# EAGLE design clickclack-mk-1.1-a (EAGLE 6.5.0)
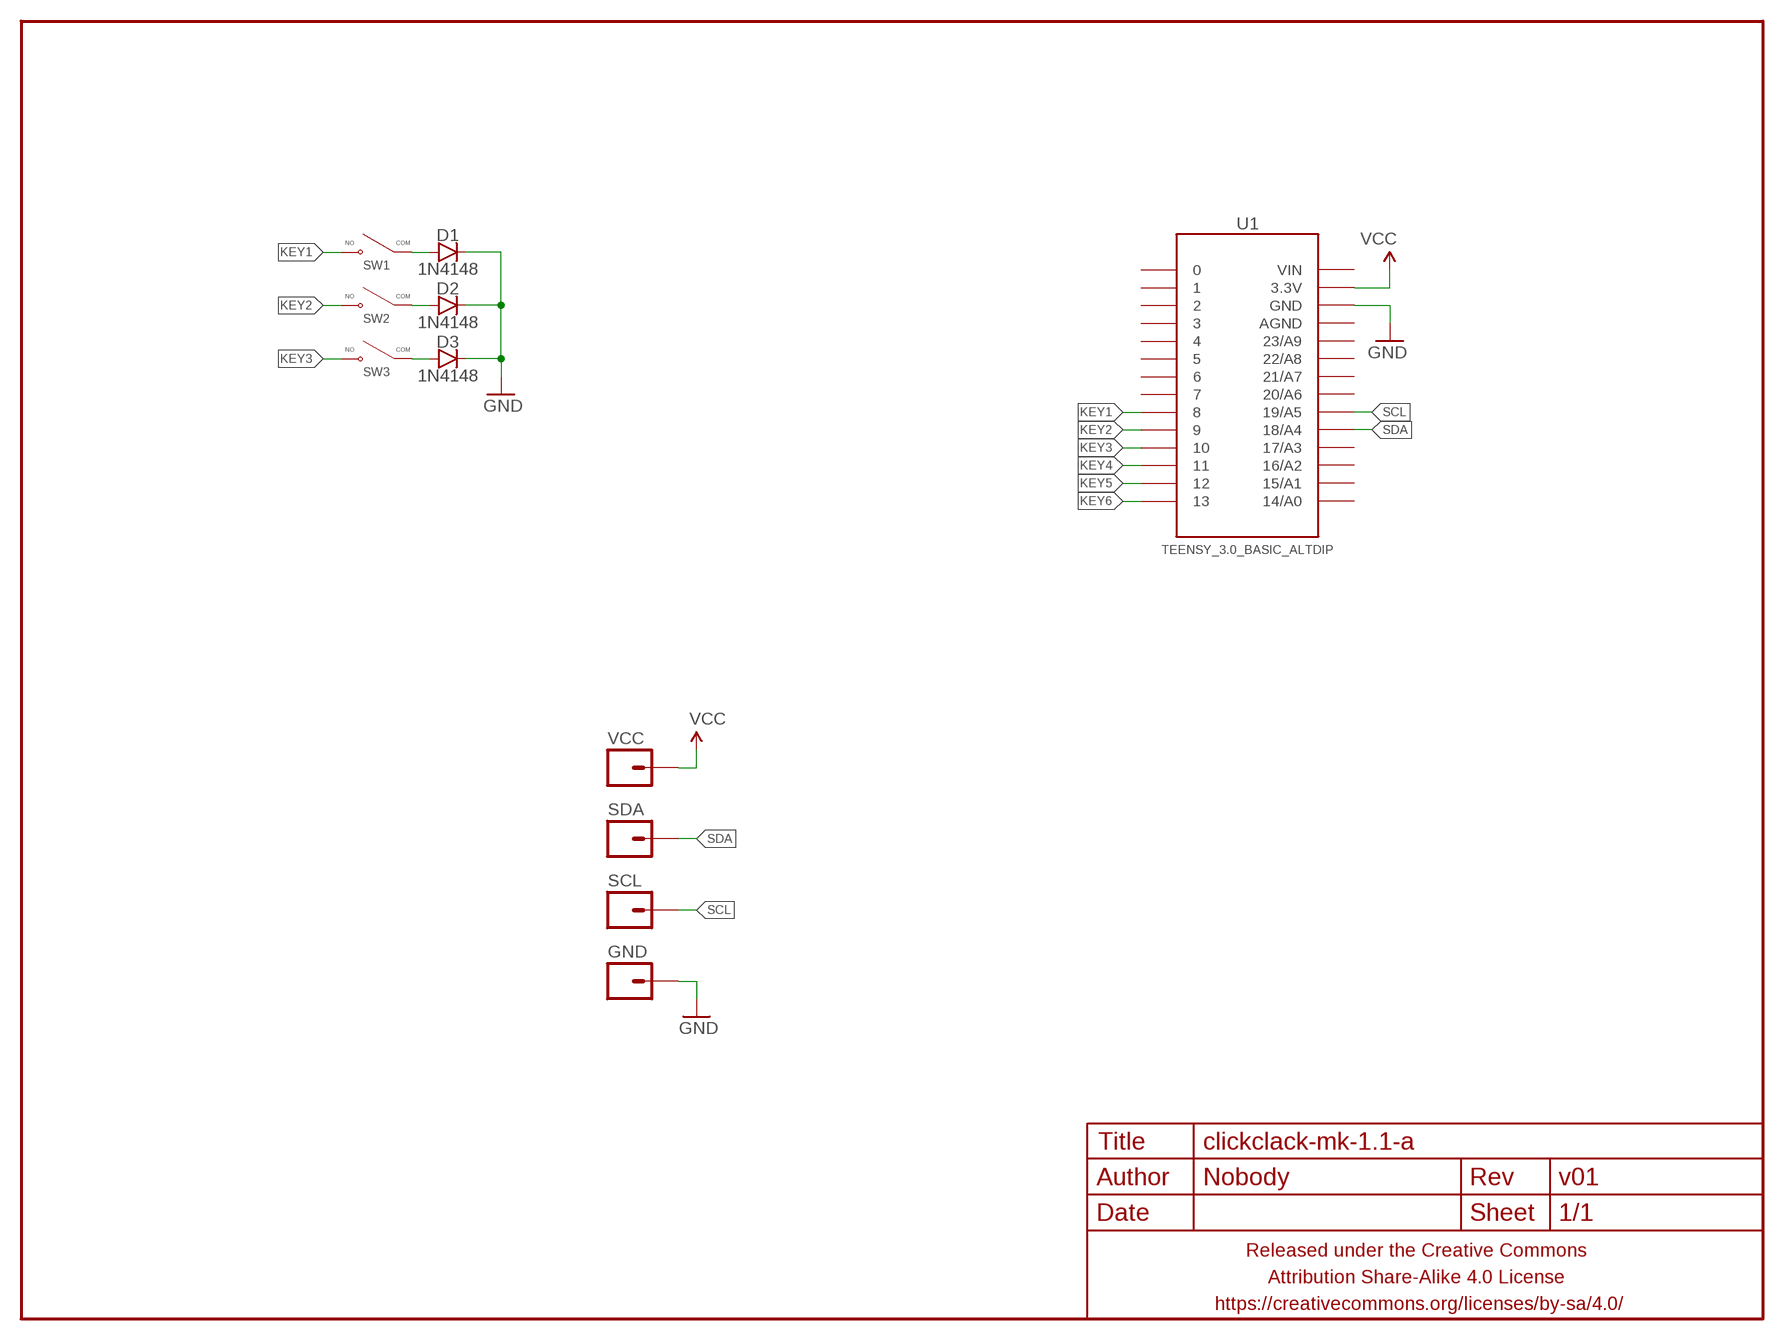
[diagram p0: schematic, sheet 1]

## Parts
D1  1N4148  DIODEPTH-7.62MM  [DIODE-7.62MM]
D2  1N4148  DIODEPTH-7.62MM  [DIODE-7.62MM]
D3  1N4148  DIODEPTH-7.62MM  [DIODE-7.62MM]
FRAME1  FRAME-LETTERNO_PACKAGE  [DUMMY]
GND  M01PTH  [1X01]
SCL  M01PTH  [1X01]
SDA  M01PTH  [1X01]
SW1  CHERRY-MXNONUBS  [CHERRY-MX-NONUBS]
SW2  CHERRY-MXNONUBS  [CHERRY-MX-NONUBS]
SW3  CHERRY-MXNONUBS  [CHERRY-MX-NONUBS]
U1  TEENSY_3.0_BASIC_ALTDIP  [TEENSY_3.0_BASIC_ALT2]
VCC  M01PTH  [1X01]

## Nets
GND: D1.K(C) D2.K(C) D3.K(C) GND.1 U1.GND
KEY1: SW1.2(NO) U1.8
KEY2: SW2.2(NO) U1.9
KEY3: SW3.2(NO) U1.10
KEY4: U1.11
KEY5: U1.12
KEY6: U1.13
N$1: D1.A SW1.1(COM)
N$2: D2.A SW2.1(COM)
N$3: D3.A SW3.1(COM)
SCL: SCL.1 U1.19/A5
SDA: SDA.1 U1.18/A4
VCC: U1.3.3V VCC.1
Unconnected: U1.0 U1.1 U1.2 U1.3 U1.4 U1.5 U1.6 U1.7 U1.14/A0 U1.15/A1 U1.16/A2 U1.17/A3 U1.20/A6 U1.21/A7 U1.22/A8 U1.23/A9

## Power pins joined to a net without a drawn wire
AGND: U1.AGND
VIN: U1.VIN

## Library data of the parts
D1-D3 = A_butts:DIODE: Diode These are standard reverse protection diodes and small signal diodes. SMA package can handle up to about 1A. SOD-323 can handle about 200mA. What the SOD-323 package when ordering, there are some mfgs out there that are 5-pin packages.
FRAME1 = A_butts:FRAME-LETTER: Schematic Frame Standard 8.5x11 US Letter frame; DESIGNER: Nobody; VERSION: v01
GND SCL SDA VCC = A_butts:M01: Header 1 Standard 1-pin 0.1" header. Use with straight break away headers (SKU : PRT-00116), right angle break away headers (PRT-00553), swiss pins (PRT-00743), machine pins (PRT-00117), and female headers (PRT-00115).
SW1-SW3 = A_butts:CHERRY-MX
U1 = A_butts:TEENSY_3.0_BASIC_ALT

## Board
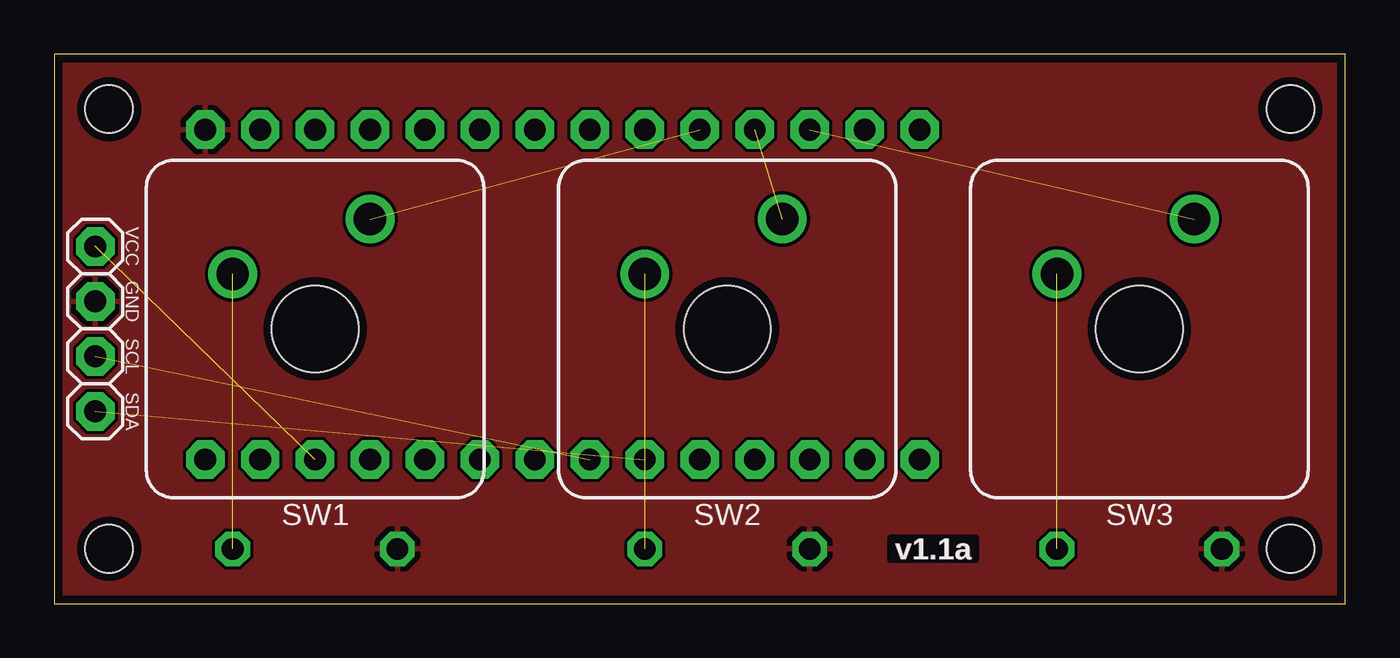
[diagram p1: board, top side]
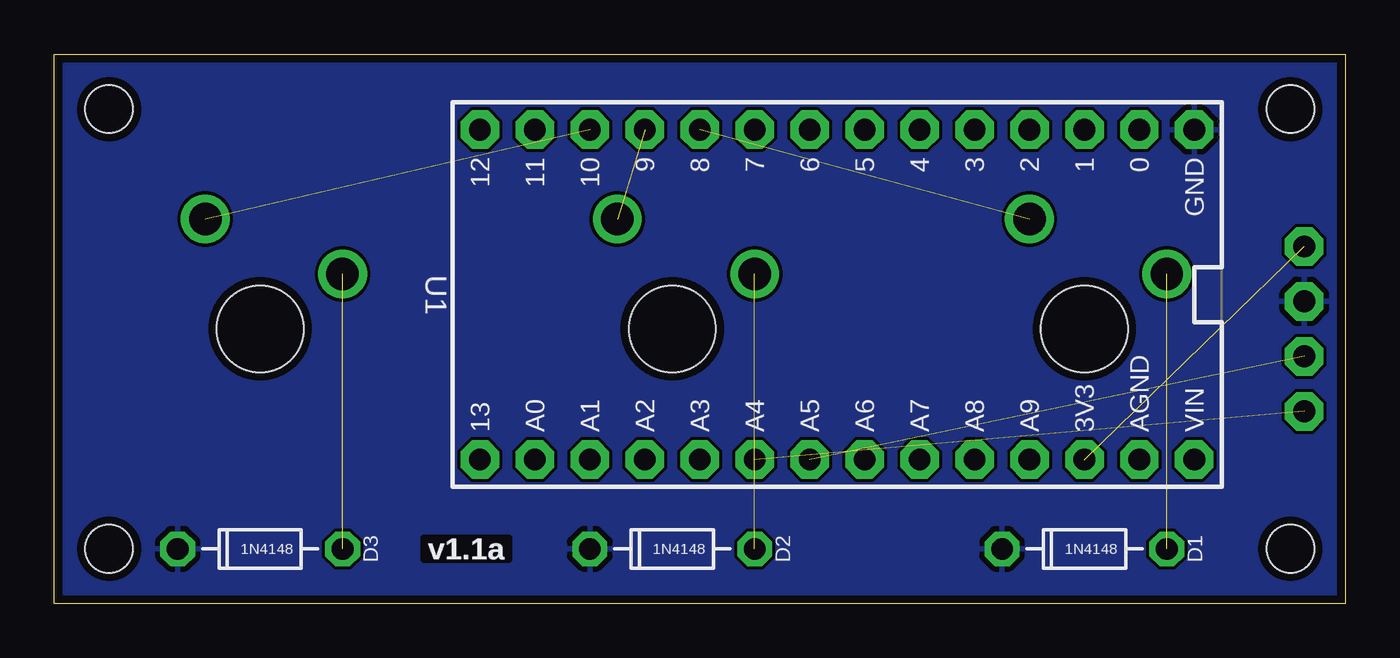
[diagram p2: board, bottom side, seen from below]

Size 59.69 x 25.4 mm. Coordinates in mm from the lower left corner, seen from the top.
Outline: 0,25.4 0,0 59.69,0 59.69,25.4 0,25.4
Copper layers (1*16): Top 0.0356mm / dielectric 1.5011mm / Bottom 0.0356mm
Design rules "LaenPCBOrder_2": minimum track width 6mil, minimum drill 13mil, track to track 6mil, track to pad 6mil, pad to pad 6mil, via to via 6mil, smd to smd 6mil, copper to edge 15mil, drill to drill 6mil, minimum pad ring 7mil, minimum via ring 7mil, stop-mask expansion 3mil, vias tented up to drill 20mil, thermal gap 10mil
Holes 2.2 mm at 2.54,22.86 2.54,2.54 57.15,22.86 57.15,2.54

### Footprints (pad centres in the part's own frame; a part is rotated, then mirrored left to right if it is on the bottom)
DIODE-7.62MM = drill 1 pad 1.6 octagon: A -3.81,0; K 3.81,0
1X01 = drill 1.016 pad 1.778 octagon: 1 0,0
CHERRY-MX-NONUBS = drill 1.5: 1 -3.81,2.54; 2 2.54,5.08 | hole 4: 0,0
TEENSY_3.0_BASIC_ALT2 = drill 1 pad 1.778 octagon: 0 -7.62,13.97; 1 -7.62,11.43; 2 -7.62,8.89; 3 -7.62,6.35; 3.3V 7.62,11.43; 4 -7.62,3.81; 5 -7.62,1.27; 6 -7.62,-1.27; 7 -7.62,-3.81; 8 -7.62,-6.35; 9 -7.62,-8.89; 10 -7.62,-11.43; 11 -7.62,-13.97; 12 -7.62,-16.51; 13 7.62,-16.51; 14/A0 7.62,-13.97; 15/A1 7.62,-11.43; 16/A2 7.62,-8.89; 17/A3 7.62,-6.35; 18/A4 7.62,-3.81; 19/A5 7.62,-1.27; 20/A6 7.62,1.27; 21/A7 7.62,3.81; 22/A8 7.62,6.35; 23/A9 7.62,8.89; AGND 7.62,13.97; GND -7.62,16.51; VIN 7.62,16.51

### Placement (x,y rotation side)
D1  12.06,2.54 180 bottom
D2  31.11,2.54 180 bottom
D3  50.16,2.54 180 bottom
FRAME1  0,0 0 top
GND  1.91,13.97 270 top
SCL  1.91,11.43 270 top
SDA  1.91,8.89 270 top
SW1  12.06,12.7 0 top
SW2  31.11,12.7 0 top
SW3  50.16,12.7 0 top
U1  23.5,14.29 270 bottom
VCC  1.91,16.51 270 top

### Tracks (layer width: path | path; a pad name or v marks a point on that pad's centre or on a via)
GND
  pour Bottom: 0,25.4 59.69,25.4 59.69,0 0,0
  pour Top: 0,25.4 59.69,25.4 59.69,0 0,0
KEY1  (1 unrouted)
KEY2  (1 unrouted)
KEY3  (1 unrouted)
N$1  (1 unrouted)
N$2  (1 unrouted)
N$3  (1 unrouted)
SCL  (1 unrouted)
SDA  (1 unrouted)
VCC  (1 unrouted)